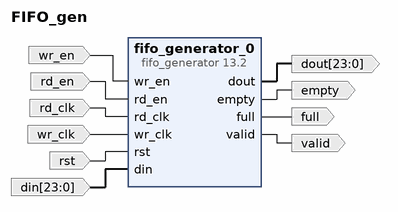
[diagram p0: block diagram of the top level]
# Vivado block design FIFO_gen, xc7z020clg400-1, Vivado 2020.2
create_bd_design FIFO_gen

create_bd_port -dir I wr_en
create_bd_port -dir I rd_en
create_bd_port -dir O full
create_bd_port -dir O empty
create_bd_port -dir O -from 23 -to 0 -type data dout
create_bd_port -dir I rst
create_bd_port -dir I wr_clk
create_bd_port -dir I rd_clk
create_bd_port -dir O valid
create_bd_port -dir I -from 23 -to 0 -type data din

create_bd_cell -type ip -vlnv xilinx.com:ip:fifo_generator:13.2 fifo_generator_0
set_property -dict [list \
  CONFIG.Enable_Safety_Circuit true \
  CONFIG.FIFO_Implementation_rach Common_Clock_Distributed_RAM \
  CONFIG.FIFO_Implementation_wach Common_Clock_Distributed_RAM \
  CONFIG.FIFO_Implementation_wrch Common_Clock_Distributed_RAM \
  CONFIG.Fifo_Implementation Independent_Clocks_Block_RAM \
  CONFIG.Full_Flags_Reset_Value 1 \
  CONFIG.INTERFACE_TYPE Native \
  CONFIG.Input_Data_Width 24 \
  CONFIG.Output_Data_Width 24 \
  CONFIG.Performance_Options First_Word_Fall_Through \
  CONFIG.Use_Extra_Logic false \
  CONFIG.Valid_Flag true \
] [get_bd_cells fifo_generator_0]

# ---- connections ----

connect_bd_net [get_bd_ports wr_en] [get_bd_pins fifo_generator_0/wr_en]
connect_bd_net -net wr_en1_1 [get_bd_ports rd_en] [get_bd_pins fifo_generator_0/rd_en]
connect_bd_net [get_bd_pins fifo_generator_0/full] [get_bd_ports full]
connect_bd_net [get_bd_pins fifo_generator_0/empty] [get_bd_ports empty]
connect_bd_net [get_bd_pins fifo_generator_0/dout] [get_bd_ports dout]
connect_bd_net [get_bd_ports rd_clk] [get_bd_pins fifo_generator_0/rd_clk]
connect_bd_net [get_bd_ports wr_clk] [get_bd_pins fifo_generator_0/wr_clk]
connect_bd_net [get_bd_ports rst] [get_bd_pins fifo_generator_0/rst]
connect_bd_net [get_bd_pins fifo_generator_0/valid] [get_bd_ports valid]
connect_bd_net [get_bd_ports din] [get_bd_pins fifo_generator_0/din]

validate_bd_design
save_bd_design
